# Altium schematic sheet main.SchDoc
size A3; SheetNumber: 1; SheetTotal: 9
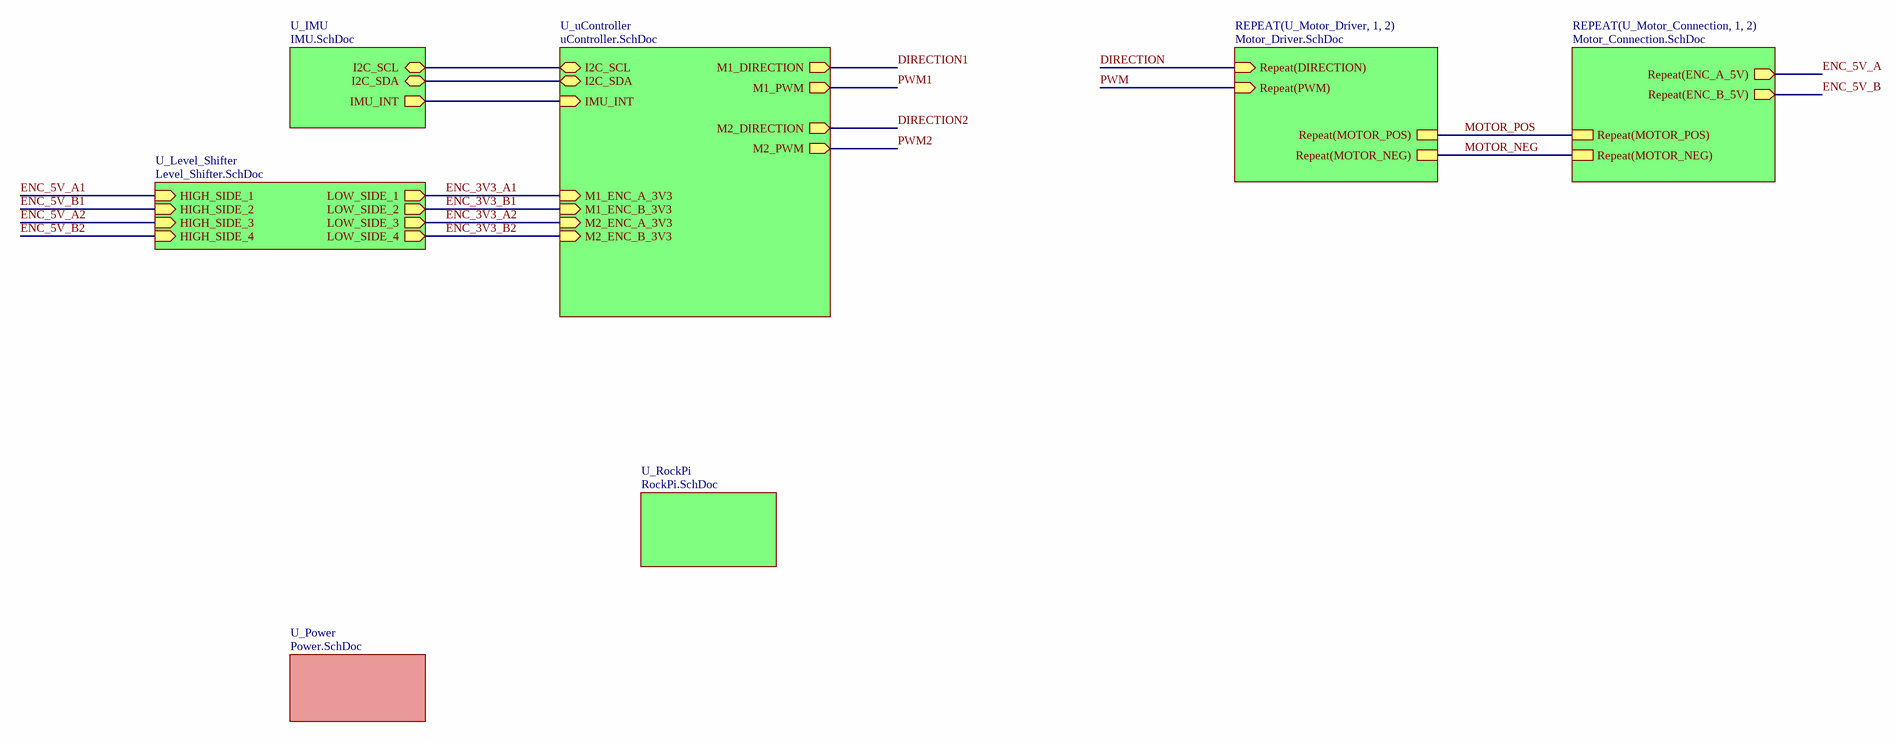
[diagram p0: main.SchDoc]

## Sub-sheets
REPEAT(U_Motor_Connection, 1, 2) = Motor_Connection.SchDoc: Repeat(MOTOR_POS), Repeat(MOTOR_NEG), Repeat(ENC_A_5V) (out), Repeat(ENC_B_5V) (out)
REPEAT(U_Motor_Driver, 1, 2) = Motor_Driver.SchDoc: Repeat(DIRECTION) (in), Repeat(MOTOR_NEG), Repeat(MOTOR_POS), Repeat(PWM) (in)
U_IMU = IMU.SchDoc: I2C_SDA (bidir), I2C_SCL (bidir), IMU_INT (out)
U_Level_Shifter = Level_Shifter.SchDoc: HIGH_SIDE_1 (in), HIGH_SIDE_2 (in), HIGH_SIDE_3 (in), HIGH_SIDE_4 (in), LOW_SIDE_1 (out), LOW_SIDE_2 (out), LOW_SIDE_3 (out), LOW_SIDE_4 (out)
U_Power = Power.SchDoc: no entries
U_RockPi = RockPi.SchDoc: no entries
U_uController = uController.SchDoc: M1_PWM (out), M1_DIRECTION (out), I2C_SCL (bidir), M2_PWM (out), M2_DIRECTION (out), I2C_SDA (bidir), IMU_INT (in), M1_ENC_A_3V3 (in), M1_ENC_B_3V3 (in), M2_ENC_A_3V3 (in), M2_ENC_B_3V3 (in)

## Nets
DIRECTION: sheet REPEAT(U_Motor_Driver, 1, 2)/Repeat(DIRECTION)
DIRECTION1: sheet U_uController/M1_DIRECTION
DIRECTION2: sheet U_uController/M2_DIRECTION
ENC_3V3_A1: sheet U_uController/M1_ENC_A_3V3, sheet U_Level_Shifter/LOW_SIDE_1
ENC_3V3_A2: sheet U_uController/M2_ENC_A_3V3, sheet U_Level_Shifter/LOW_SIDE_3
ENC_3V3_B1: sheet U_uController/M1_ENC_B_3V3, sheet U_Level_Shifter/LOW_SIDE_2
ENC_3V3_B2: sheet U_uController/M2_ENC_B_3V3, sheet U_Level_Shifter/LOW_SIDE_4
ENC_5V_A: sheet REPEAT(U_Motor_Connection, 1, 2)/Repeat(ENC_A_5V)
ENC_5V_A1: sheet U_Level_Shifter/HIGH_SIDE_1
ENC_5V_A2: sheet U_Level_Shifter/HIGH_SIDE_3
ENC_5V_B: sheet REPEAT(U_Motor_Connection, 1, 2)/Repeat(ENC_B_5V)
ENC_5V_B1: sheet U_Level_Shifter/HIGH_SIDE_2
ENC_5V_B2: sheet U_Level_Shifter/HIGH_SIDE_4
MOTOR_NEG: sheet REPEAT(U_Motor_Driver, 1, 2)/Repeat(MOTOR_NEG), sheet REPEAT(U_Motor_Connection, 1, 2)/Repeat(MOTOR_NEG)
MOTOR_POS: sheet REPEAT(U_Motor_Driver, 1, 2)/Repeat(MOTOR_POS), sheet REPEAT(U_Motor_Connection, 1, 2)/Repeat(MOTOR_POS)
PWM: sheet REPEAT(U_Motor_Driver, 1, 2)/Repeat(PWM)
PWM1: sheet U_uController/M1_PWM
PWM2: sheet U_uController/M2_PWM
(unnamed): sheet U_uController/I2C_SCL, sheet U_IMU/I2C_SCL
(unnamed): sheet U_uController/I2C_SDA, sheet U_IMU/I2C_SDA
(unnamed): sheet U_uController/IMU_INT, sheet U_IMU/IMU_INT

## Notes on the sheet
- Sheet Title
- Design Title
- Sheet
- SIZE
- A3
- Designer
- PCB Code
- PCB Rev
- Approver
- Assembly Code
- Issue
- EC No.
- Approved Date